# Altium schematic sheet camera_connector.SchDoc
size A2; DrawnBy: Elio F; Engineer: Elio F; Revision: A; SheetNumber: 7; SheetTotal: 11; Sheet Title: Connector Camera Module
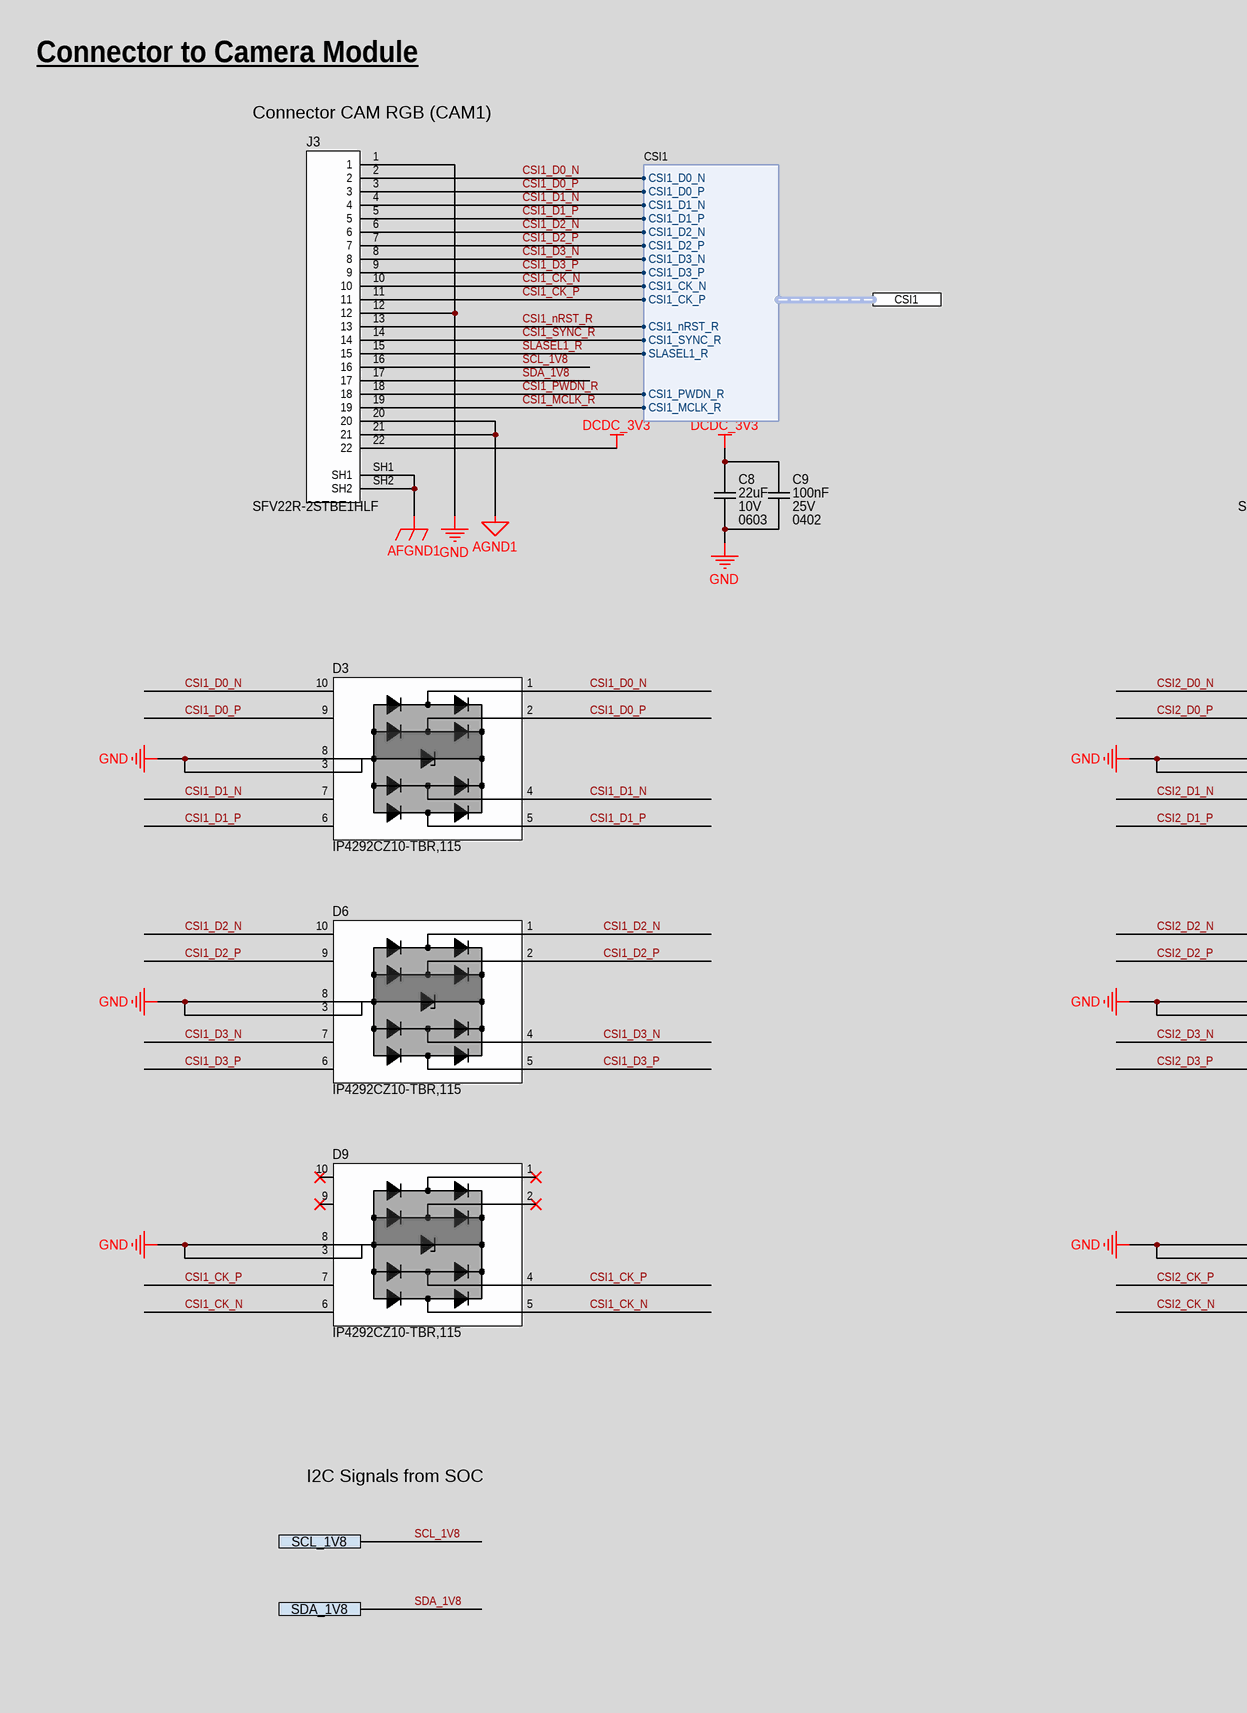
[diagram p0: camera_connector.SchDoc, left]
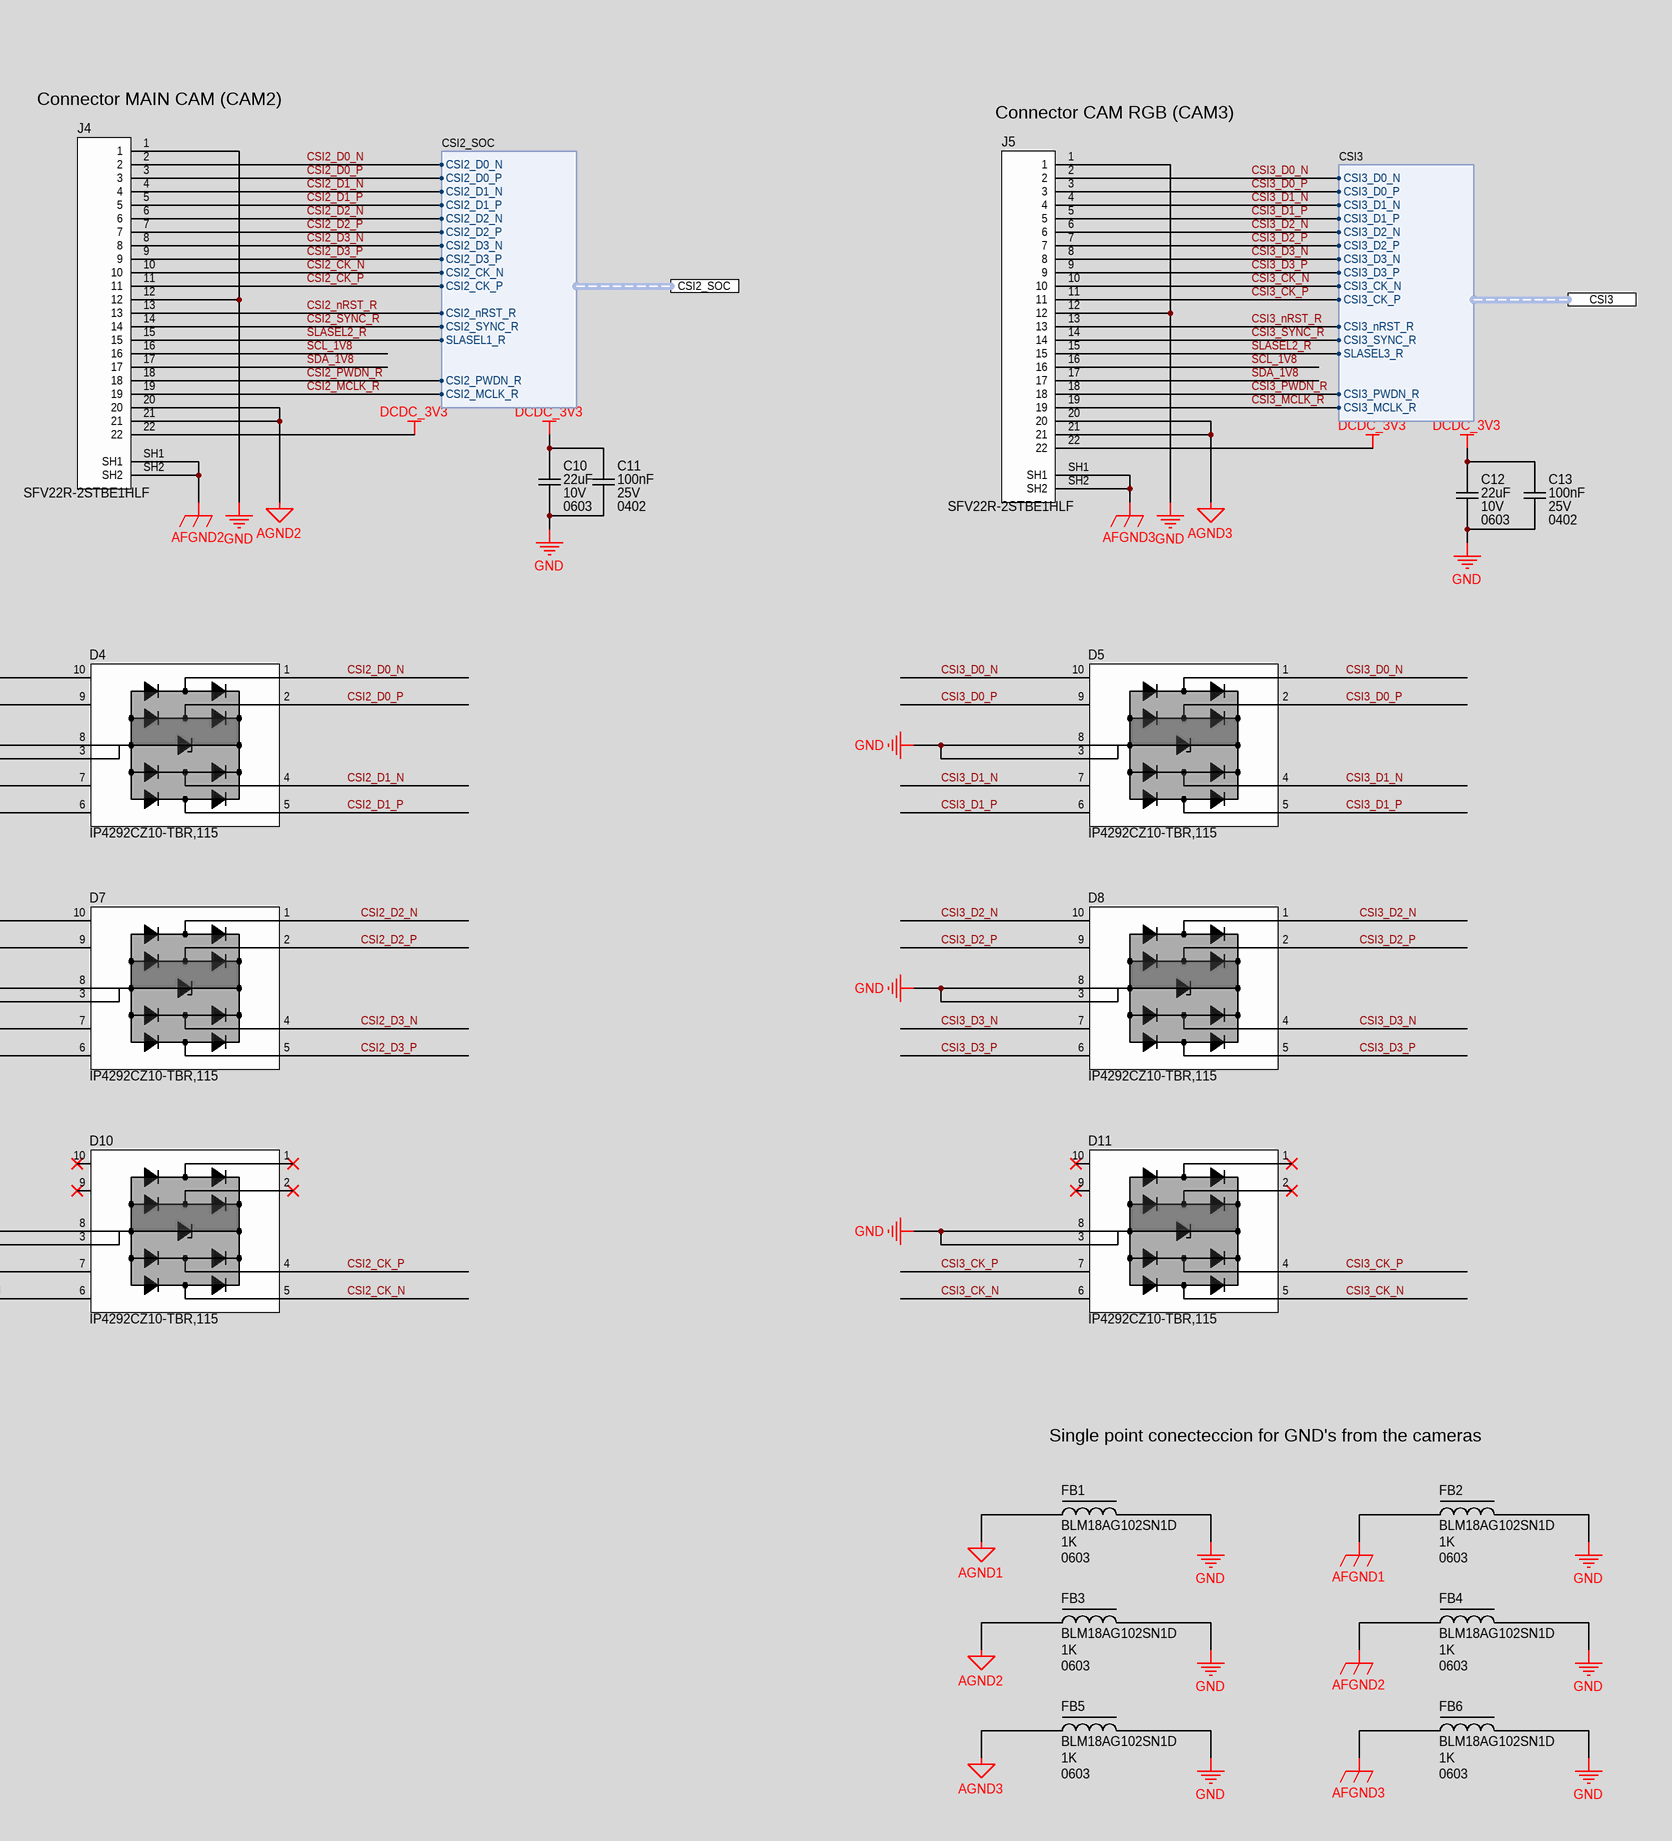
[diagram p1: camera_connector.SchDoc, right]

## Parts
C8  Capacitance: 22uF  Voltage Rating: 10V  Case Code (Imperial): 0603  [CAP_0603_CAPC1608X08N]  (hidden comment: C1608X5R1A226M080AC)
C9  Capacitance: 100nF  Voltage Rating: 25V  Case/Package: 0402  [CAP_0402_CAPC1005X05N]  (hidden comment: CC0402KRX5R8BB104)
C10  Capacitance: 22uF  Voltage Rating: 10V  Case Code (Imperial): 0603  [CAP_0603_CAPC1608X08N]  (hidden comment: C1608X5R1A226M080AC)
C11  Capacitance: 100nF  Voltage Rating: 25V  Case/Package: 0402  [CAP_0402_CAPC1005X05N]  (hidden comment: CC0402KRX5R8BB104)
C12  Capacitance: 22uF  Voltage Rating: 10V  Case Code (Imperial): 0603  [CAP_0603_CAPC1608X08N]  (hidden comment: C1608X5R1A226M080AC)
C13  Capacitance: 100nF  Voltage Rating: 25V  Case/Package: 0402  [CAP_0402_CAPC1005X05N]  (hidden comment: CC0402KRX5R8BB104)
D3  IP4292CZ10-TBR,115  [DIO_TVS_SON50P100X250X50-10N]
D4  IP4292CZ10-TBR,115  [DIO_TVS_SON50P100X250X50-10N]
D5  IP4292CZ10-TBR,115  [DIO_TVS_SON50P100X250X50-10N]
D6  IP4292CZ10-TBR,115  [DIO_TVS_SON50P100X250X50-10N]
D7  IP4292CZ10-TBR,115  [DIO_TVS_SON50P100X250X50-10N]
D8  IP4292CZ10-TBR,115  [DIO_TVS_SON50P100X250X50-10N]
D9  IP4292CZ10-TBR,115  [DIO_TVS_SON50P100X250X50-10N]
D10  IP4292CZ10-TBR,115  [DIO_TVS_SON50P100X250X50-10N]
D11  IP4292CZ10-TBR,115  [DIO_TVS_SON50P100X250X50-10N]
FB1  BLM18AG102SN1D  Impedance: 1K  Case/Package: 0603  [IND_0603_INDC1608X08N]
FB2  BLM18AG102SN1D  Impedance: 1K  Case/Package: 0603  [IND_0603_INDC1608X08N]
FB3  BLM18AG102SN1D  Impedance: 1K  Case/Package: 0603  [IND_0603_INDC1608X08N]
FB4  BLM18AG102SN1D  Impedance: 1K  Case/Package: 0603  [IND_0603_INDC1608X08N]
FB5  BLM18AG102SN1D  Impedance: 1K  Case/Package: 0603  [IND_0603_INDC1608X08N]
FB6  BLM18AG102SN1D  Impedance: 1K  Case/Package: 0603  [IND_0603_INDC1608X08N]
J3  SFV22R-2STBE1HLF  [CONN_FPC_AMPHENOL_SFV22R-2STBE1HLF]
J4  SFV22R-2STBE1HLF  [CONN_FPC_AMPHENOL_SFV22R-2STBE1HLF]
J5  SFV22R-2STBE1HLF  [CONN_FPC_AMPHENOL_SFV22R-2STBE1HLF]

## Ports
CSI1 (harness CSI1), CSI2_SOC (harness CSI2_SOC), CSI3 (harness CSI3), SCL_1V8, SDA_1V8

## Harnesses
CSI1: CSI1_D0_N, CSI1_D0_P, CSI1_D1_N, CSI1_D1_P, CSI1_D2_N, CSI1_D2_P, CSI1_D3_N, CSI1_D3_P, CSI1_CK_N, CSI1_CK_P, CSI1_nRST_R, CSI1_SYNC_R, SLASEL1_R, CSI1_PWDN_R, CSI1_MCLK_R
CSI2_SOC: CSI2_D0_N, CSI2_D0_P, CSI2_D1_N, CSI2_D1_P, CSI2_D2_N, CSI2_D2_P, CSI2_D3_N, CSI2_D3_P, CSI2_CK_N, CSI2_CK_P, CSI2_nRST_R, CSI2_SYNC_R, SLASEL1_R, CSI2_PWDN_R, CSI2_MCLK_R
CSI3: CSI3_D0_N, CSI3_D0_P, CSI3_D1_N, CSI3_D1_P, CSI3_D2_N, CSI3_D2_P, CSI3_D3_N, CSI3_D3_P, CSI3_CK_N, CSI3_CK_P, CSI3_nRST_R, CSI3_SYNC_R, SLASEL3_R, CSI3_PWDN_R, CSI3_MCLK_R

## Nets
AFGND1: FB2.1 J3.SH1 J3.SH2
AFGND2: FB4.1 J4.SH1 J4.SH2
AFGND3: FB6.1 J5.SH1 J5.SH2
AGND1: FB1.1 J3.20 J3.21
AGND2: FB3.1 J4.20 J4.21
AGND3: FB5.1 J5.20 J5.21
DCDC_3V3: C8.2 C9.2 C10.2 C11.2 C12.2 C13.2 J3.22 J4.22 J5.22
GND: C8.1 C9.1 C10.1 C11.1 C12.1 C13.1 D3.3(GND1) D3.8(GND2) D4.3(GND1) D4.8(GND2) D5.3(GND1) D5.8(GND2) D6.3(GND1) D6.8(GND2) D7.3(GND1) D7.8(GND2) D8.3(GND1) D8.8(GND2) D9.3(GND1) D9.8(GND2) D10.3(GND1) D10.8(GND2) D11.3(GND1) D11.8(GND2) FB1.2 FB2.2 FB3.2 FB4.2 FB5.2 FB6.2 J3.1 J3.12 J4.1 J4.12 J5.1 J5.12
CSI1_CK_N: D9.5(CH4) D9.6(NC1) J3.10 ; port CSI1.CSI1_CK_N
CSI1_CK_P: D9.4(CH3) D9.7(NC2) J3.11 ; port CSI1.CSI1_CK_P
CSI1_D0_N: D3.1(CH1) D3.10(NC4) J3.2 ; port CSI1.CSI1_D0_N
CSI1_D0_P: D3.2(CH2) D3.9(NC3) J3.3 ; port CSI1.CSI1_D0_P
CSI1_D1_N: D3.4(CH3) D3.7(NC2) J3.4 ; port CSI1.CSI1_D1_N
CSI1_D1_P: D3.5(CH4) D3.6(NC1) J3.5 ; port CSI1.CSI1_D1_P
CSI1_D2_N: D6.1(CH1) D6.10(NC4) J3.6 ; port CSI1.CSI1_D2_N
CSI1_D2_P: D6.2(CH2) D6.9(NC3) J3.7 ; port CSI1.CSI1_D2_P
CSI1_D3_N: D6.4(CH3) D6.7(NC2) J3.8 ; port CSI1.CSI1_D3_N
CSI1_D3_P: D6.5(CH4) D6.6(NC1) J3.9 ; port CSI1.CSI1_D3_P
CSI1_MCLK_R: J3.19 ; port CSI1.CSI1_MCLK_R
CSI1_nRST_R: J3.13 ; port CSI1.CSI1_nRST_R
CSI1_PWDN_R: J3.18 ; port CSI1.CSI1_PWDN_R
CSI1_SYNC_R: J3.14 ; port CSI1.CSI1_SYNC_R
CSI2_CK_N: D10.5(CH4) D10.6(NC1) J4.10 ; port CSI2_SOC.CSI2_CK_N
CSI2_CK_P: D10.4(CH3) D10.7(NC2) J4.11 ; port CSI2_SOC.CSI2_CK_P
CSI2_D0_N: D4.1(CH1) D4.10(NC4) J4.2 ; port CSI2_SOC.CSI2_D0_N
CSI2_D0_P: D4.2(CH2) D4.9(NC3) J4.3 ; port CSI2_SOC.CSI2_D0_P
CSI2_D1_N: D4.4(CH3) D4.7(NC2) J4.4 ; port CSI2_SOC.CSI2_D1_N
CSI2_D1_P: D4.5(CH4) D4.6(NC1) J4.5 ; port CSI2_SOC.CSI2_D1_P
CSI2_D2_N: D7.1(CH1) D7.10(NC4) J4.6 ; port CSI2_SOC.CSI2_D2_N
CSI2_D2_P: D7.2(CH2) D7.9(NC3) J4.7 ; port CSI2_SOC.CSI2_D2_P
CSI2_D3_N: D7.4(CH3) D7.7(NC2) J4.8 ; port CSI2_SOC.CSI2_D3_N
CSI2_D3_P: D7.5(CH4) D7.6(NC1) J4.9 ; port CSI2_SOC.CSI2_D3_P
CSI2_MCLK_R: J4.19 ; port CSI2_SOC.CSI2_MCLK_R
CSI2_nRST_R: J4.13 ; port CSI2_SOC.CSI2_nRST_R
CSI2_PWDN_R: J4.18 ; port CSI2_SOC.CSI2_PWDN_R
CSI2_SYNC_R: J4.14 ; port CSI2_SOC.CSI2_SYNC_R
CSI3_CK_N: D11.5(CH4) D11.6(NC1) J5.10 ; port CSI3.CSI3_CK_N
CSI3_CK_P: D11.4(CH3) D11.7(NC2) J5.11 ; port CSI3.CSI3_CK_P
CSI3_D0_N: D5.1(CH1) D5.10(NC4) J5.2 ; port CSI3.CSI3_D0_N
CSI3_D0_P: D5.2(CH2) D5.9(NC3) J5.3 ; port CSI3.CSI3_D0_P
CSI3_D1_N: D5.4(CH3) D5.7(NC2) J5.4 ; port CSI3.CSI3_D1_N
CSI3_D1_P: D5.5(CH4) D5.6(NC1) J5.5 ; port CSI3.CSI3_D1_P
CSI3_D2_N: D8.1(CH1) D8.10(NC4) J5.6 ; port CSI3.CSI3_D2_N
CSI3_D2_P: D8.2(CH2) D8.9(NC3) J5.7 ; port CSI3.CSI3_D2_P
CSI3_D3_N: D8.4(CH3) D8.7(NC2) J5.8 ; port CSI3.CSI3_D3_N
CSI3_D3_P: D8.5(CH4) D8.6(NC1) J5.9 ; port CSI3.CSI3_D3_P
CSI3_MCLK_R: J5.19 ; port CSI3.CSI3_MCLK_R
CSI3_nRST_R: J5.13 ; port CSI3.CSI3_nRST_R
CSI3_PWDN_R: J5.18 ; port CSI3.CSI3_PWDN_R
CSI3_SYNC_R: J5.14 ; port CSI3.CSI3_SYNC_R
SCL_1V8: J3.16 J4.16 J5.16 ; port SCL_1V8
SDA_1V8: J3.17 J4.17 J5.17 ; port SDA_1V8
SLASEL1_R: J3.15 ; port CSI1.SLASEL1_R
SLASEL2_R: J4.15 J5.15 ; port CSI2_SOC.SLASEL1_R, port CSI3.SLASEL3_R

Not connected (* = marked no-connect by the designer): D9 1(CH1)* 2(CH2)* 9(NC3)* 10(NC4)*; D10 1(CH1)* 2(CH2)* 9(NC3)* 10(NC4)*; D11 1(CH1)* 2(CH2)* 9(NC3)* 10(NC4)*

## Notes on the sheet
- Connector to Camera Module
- (near J3) Connector CAM RGB (CAM1)
- (near J4) Connector MAIN CAM (CAM2)
- (near J5) Connector CAM RGB (CAM3)
- I2C Signals from SOC
- Single point conecteccion for GND's from the cameras
- PCB Des :
- Approv By :
- Project Title :
- Sheet Title :
- Date :
- Page :
- PCB Version :
- PCB Revision :
- Size :
- A2

## Library data of the parts
C8 C10 C12 = CAP_22UF_10V_X5R_0603: Multilayer Ceramic Capacitor, 22 uF, 10 V, ± 20%, X5R, 0603 [1608 Metric]; Manufacturer: TDK; Supplier 1: Digi-Key; Manufacturer Part Number: C1608X5R1A226M080AC; RoHS: Yes; Category: Ceramic Capacitors; Stock 1: 1971709; Pricing 1: 1=0.32, 10=0.208, 50=0.1534, 100=0.1248, 500=0.09856, 1000=0.08323 (USD); Mount: Surface Mount; Case/Package: 0603; Case Code (Metric): 1608; Dielectric Material: Ceramic; Weight: 7.1E-05oz; Min Operating Temperature: -55°C; Max Operating Temperature: 85°C; Tolerance: 20%; Packaging: Tape and Reel; Voltage Rating (DC): 10V; Termination: SMD/SMT; Series: C; Package Quantity: 4000; Dielectric: X5R; Length: 1.6mm; Width: 0.8mm; Height: 0.8mm; Reach SVHC Compliant: No; Lead Free: Lead Free; RoHS Compliant: Yes; ComponentLink1URL: https://datasheet.ciiva.com/6274/tdkmlcccaprange-6274860.pdf?src-supplier=Digi-Key; ComponentLink1Description: https://datasheet.ciiva.com/6274/tdkmlcccaprange-6274860.pdf?src-supplier=Digi-Key; ComponentLink2URL: https://datasheet.ciiva.com/6274/tdkmlcccaprange-6274859.pdf?src-supplier=Digi-Key; ComponentLink2Description: https://datasheet.ciiva.com/6274/tdkmlcccaprange-6274859.pdf?src-supplier=Digi-Key; ComponentLink3URL: https://datasheet.ciiva.com/6274/tdkmlcccaprange-6274861.pdf?src-supplier=Digi-Key; ComponentLink3Description: https://datasheet.ciiva.com/6274/tdkmlcccaprange-6274861.pdf?src-supplier=Digi-Key; ComponentLink4URL: https://datasheet.ciiva.com/24216/mlcc-commercial-general-en-24216575.pdf?src-supplier=Mouser; ComponentLink4Description: https://datasheet.ciiva.com/24216/mlcc-commercial-general-en-24216575.pdf?src-supplier=Mouser; Supplier Part Number 1: 445-9077-1-ND
C9 C11 C13 = CAP_100NF_25V_X7R_0402: Multilayer Ceramic Capacitor, 0.1 uF, 25 V, ± 10%, X7R, 0402 [1005 Metric]; Manufacturer: Yageo; Material: 4241ConductorMaterial; Dielectric: X5R; Temperature Coefficient: 30ppm/°C; Supplier 1: Digikey; Manufacturer Part Number: CC0402KRX5R8BB104; RoHS: Yes; Category: Ceramic Capacitors; Stock 1: 3706055; Pricing 1: 1=0.1, 10=0.037, 50=0.021, 100=0.0162, 500=0.01224, 1000=0.00961, 2500=0.00874, 5000=0.00804 (USD); Mount: Surface Mount; Case Code (Metric): 1005; Case Code (Imperial): 0402; Min Operating Temperature: -55°C; Max Operating Temperature: 85°C; Tolerance: 10%; Packaging: Tape and Reel; Voltage Rating (DC): 25V; Series: CC; RoHS Compliant: Yes; Lead Free: 5697LeadFree; Halogen Free: 5694HalogenFree; ComponentLink1URL: http://www.mouser.com/ds/2/447/UPY-GPHC_X5R_4V-to-50V_25-1131599.pdf?src-supplier=Mouser; ComponentLink1Description: http://www.mouser.com/ds/2/447/UPY-GPHC_X5R_4V-to-50V_25-1131599.pdf?src-supplier=Mouser; ComponentLink2URL: https://datasheet.octopart.com/CC0402KRX5R8BB104-Yageo-datasheet-137700082.pdf?src-supplier=Future+Electronics; ComponentLink2Description: https://datasheet.octopart.com/CC0402KRX5R8BB104-Yageo-datasheet-137700082.pdf?src-supplier=Future+Electronics; ComponentLink3URL: http://www.yageo.com/documents/recent/UPY-GPHC_X5R_4V-to-50V_25.pdf?src-supplier=Digikey; ComponentLink3Description: http://www.yageo.com/documents/recent/UPY-GPHC_X5R_4V-to-50V_25.pdf?src-supplier=Digikey; ComponentLink4URL: https://datasheet.octopart.com/CC0402KRX5R8BB104-Yageo-datasheet-140260304.pdf?src-supplier=Newark; ComponentLink4Description: https://datasheet.octopart.com/CC0402KRX5R8BB104-Yageo-datasheet-140260304.pdf?src-supplier=Newark; ComponentLink5URL: https://datasheet.octopart.com/CC0402KRX5R8BB104-Yageo-datasheet-170350636.pdf?src-supplier=Future+Electronics; ComponentLink5Description: https://datasheet.octopart.com/CC0402KRX5R8BB104-Yageo-datasheet-170350636.pdf?src-supplier=Future+Electronics; ComponentLink6URL: http://www.yageo.com/documents/recent/UPY-GPHC_X5R_4V-to-50V-16.pdf?src-supplier=Future+Electronics; ComponentLink6Description: http://www.yageo.com/documents/recent/UPY-GPHC_X5R_4V-to-50V-16.pdf?src-supplier=Future+Electronics; Supplier Part Number 1: 311-1697-6-ND
D3-D11 = DIO_TVS_4CH_4V_IP4292CZ10-TBR,115: IP4292CZ10 Series 4 Channel 4 V 0.55 pF ESD Protected TVS Diode - DFN2510A-10; Manufacturer: Nexperia; Supplier 1: Digikey; Manufacturer Part Number: IP4292CZ10-TBR,115; RoHS: Yes; Category: ESD and Circuit Protection ICs; Stock 1: 24808; Pricing 1: 1=0.51, 10=0.398, 100=0.2386, 500=0.22096, 1000=0.15025, 2000=0.13833 (USD); RoHS Compliant: Yes; ComponentLink1URL: https://assets.nexperia.com/documents/data-sheet/IP4292CZ10-TBR.pdf?src-supplier=Digikey; ComponentLink1Description: https://assets.nexperia.com/documents/data-sheet/IP4292CZ10-TBR.pdf?src-supplier=Digikey; Supplier Part Number 1: 1727-1219-1-ND
FB1-FB6 = IND_FERRITA_1K_450mA_BLM18AG102SN1D: Ferrite Beads Multi-Layer 1KOhm 25% 100MHz 450mA 500mOhm DCR 0603 T/R; Manufacturer: Murata; Material: Steel,Ferrite; Max DC Current: 400mA; DC Resistance (DCR): 500mR; Number of Lines: 1; Shielding: Unshielded; DC Resistance-Max: 700mR; Supplier 1: Digikey; Manufacturer Part Number: BLM18AG102SN1D; RoHS: Yes; Category: Ferrite Beads and Chips; Stock 1: 632067; Pricing 1: 1=0.1, 10=0.074, 25=0.0676, 50=0.0608, 100=0.0445, 250=0.0324, 500=0.02968, 1000=0.02564 (USD); Number of Pins: 2; Core Material: Ferrite; Case Code (Metric): 1608; Case Code (Imperial): 0603; Min Operating Temperature: -55°C; Max Operating Temperature: 125°C; Tolerance: 25%; Package Quantity: 1; Resistance: 500mR; Packaging: Tape and Reel; Current Rating: 400mA; Max Current Rating: 400mA; Termination: SMD/SMT; Test Frequency: 100MHz; DC Current: 400mA; Frequency: 100MHz; Number of Circuits: 1; Series: BLM18A; RMS Current (Irms): 450mA; Series Resistance: 500mR; Length: 1.6mm; Width: 0.8mm; Height: 0.8mm; Depth: 0.8mm; Radiation Hardening: No; Reach SVHC Compliant: No; Military Standard: Not; Lead Free: Lead Free; RoHS Compliant: Yes; ComponentLink1URL: https://datasheet.ciiva.com/1012/l0110s0100blm18a-1012016.pdf?src-supplier=Digikey; ComponentLink1Description: https://datasheet.ciiva.com/1012/l0110s0100blm18a-1012016.pdf?src-supplier=Digikey; ComponentLink2URL: https://datasheet.ciiva.com/5709/1756147-5709056.pdf?src-supplier=Farnell; ComponentLink2Description: https://datasheet.ciiva.com/5709/1756147-5709056.pdf?src-supplier=Farnell; ComponentLink3URL: https://datasheet.ciiva.com/11795/0900766b80032ea2-11795437.pdf?src-supplier=Rs; ComponentLink3Description: https://datasheet.ciiva.com/11795/0900766b80032ea2-11795437.pdf?src-supplier=Rs; ComponentLink4URL: https://datasheet.ciiva.com/29347/442253-da-01-en-chip-drossel-0603-1000r-400ma-1-6x0-8mm-29347887.pdf?src-supplier=Conrad; ComponentLink4Description: https://datasheet.ciiva.com/29347/442253-da-01-en-chip-drossel-0603-1000r-400ma-1-6x0-8mm-29347887.pdf?src-supplier=Conrad; ComponentLink5URL: https://datasheet.ciiva.com/41449/001172220-da-01-en-drossel-0603-1000r-1-6x0-8mm-4000st-41449508.pdf?src-supplier=Conrad; ComponentLink5Description: https://datasheet.ciiva.com/41449/001172220-da-01-en-drossel-0603-1000r-1-6x0-8mm-4000st-41449508.pdf?src-supplier=Conrad; ComponentLink6URL: https://datasheet.ciiva.com/1012/l0110s0100blm18a-1012014.pdf?src-supplier=Digikey; ComponentLink6Description: https://datasheet.ciiva.com/1012/l0110s0100blm18a-1012014.pdf?src-supplier=Digikey; ComponentLink7URL: https://datasheet.ciiva.com/1012/l0110s0100blm18a-1012015.pdf?src-supplier=Digikey; ComponentLink7Description: https://datasheet.ciiva.com/1012/l0110s0100blm18a-1012015.pdf?src-supplier=Digikey; ComponentLink8URL: https://datasheet.ciiva.com/16199/l0110s0100blm18a-16199225.pdf?src-supplier=Future+Electronics; ComponentLink8Description: https://datasheet.ciiva.com/16199/l0110s0100blm18a-16199225.pdf?src-supplier=Future+Electronics; ComponentLink9URL: https://datasheet.ciiva.com/8510/l0110s0100blm18a-8510154.pdf?src-supplier=Avnet; ComponentLink9Description: https://datasheet.ciiva.com/8510/l0110s0100blm18a-8510154.pdf?src-supplier=Avnet; ComponentLink10URL: https://datasheet.ciiva.com/1466/1756147-1466919.pdf?src-supplier=Element14; ComponentLink10Description: https://datasheet.ciiva.com/1466/1756147-1466919.pdf?src-supplier=Element14; ComponentLink11URL: https://datasheet.ciiva.com/1466/1756147-1466920.pdf?src-supplier=Element14; ComponentLink11Description: https://datasheet.ciiva.com/1466/1756147-1466920.pdf?src-supplier=Element14; Supplier Part Number 1: 490-1015-1-ND
J3-J5 = CONN_FPC_22P_0.5mm_SFV22R-2STBE1HLF: Conn FFC/FPC Connector SKT 22 POS 0.5mm Solder RA SMD Embossed T/R; Manufacturer: Amphenol ICC / FCI; Actuator Material: Glass,Polyphenylene; Voltage Rating: 50V; Current Rating: 500mA; Number of Positions: 22; Contact Location: Top; Insulation Resistance: 100MR; Wire/Cable Type: Straight; Supplier 1: Digikey; Manufacturer Part Number: SFV22R-2STBE1HLF; RoHS: Yes; Category: FFC / FPC; Stock 1: 4153; Pricing 1: 1=0.74, 10=0.627, 25=0.6016, 50=0.5888, 100=0.5633, 250=0.51208, 500=0.46086, 1000=0.40966 (USD); Mount: Surface Mount; Contact Material: Bronze; Contact Plating: Gold; Housing Material: Polymer; Min Operating Temperature: -55°C; Max Operating Temperature: 105°C; Termination: Solder; Number of Contacts: 22; Orientation: Right Angle; Packaging: Tape and Reel; Package Quantity: 3000; Series: SFV-R; Pitch: 0.5mm; Radiation Hardening: No; Flammability Rating: UL94 V-0; RoHS Compliant: Yes; ComponentLink1URL: https://datasheet.ciiva.com/18563/sfv12b-hlf-18563830.pdf?src-supplier=Digikey; ComponentLink1Description: https://datasheet.ciiva.com/18563/sfv12b-hlf-18563830.pdf?src-supplier=Digikey; Supplier Part Number 1: 609-SFV22R-2STBE1HLFCT-ND